# EAGLE design split_node_02 (EAGLE 9.6.2)
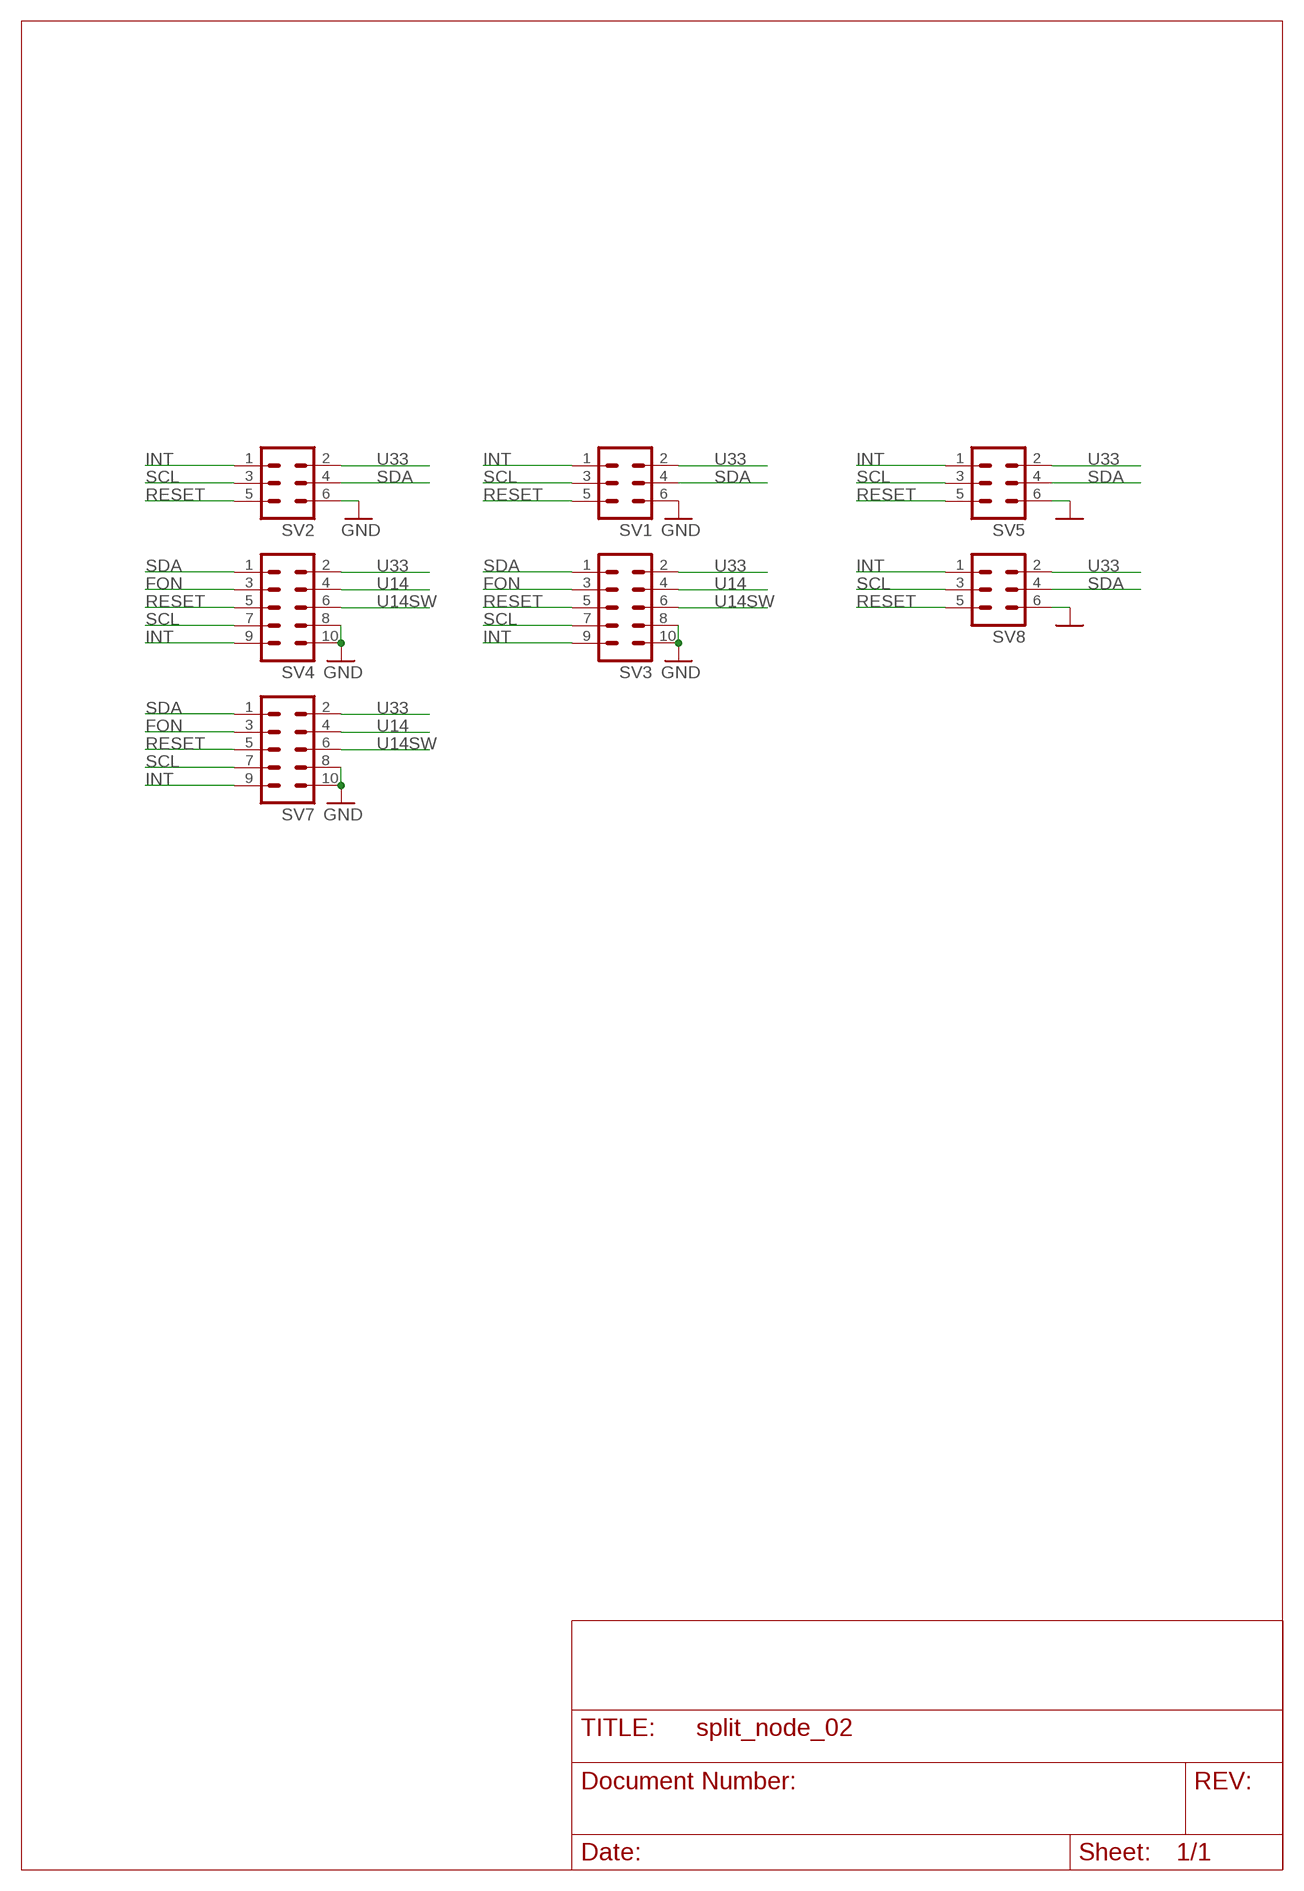
[diagram p0: schematic, sheet 1]

## Parts
SV1  ML6  [ML6]
SV2  ML6  [ML6]
SV3  ML10  [ML10]
SV4  ML10  [ML10]
SV5  ML6  [ML6]
SV7  ML10  [ML10]
SV8  ML6  [ML6]

## Nets
FON: SV3.3 SV4.3 SV7.3
GND: SV1.6 SV2.6 SV3.8 SV3.10 SV4.8 SV4.10 SV5.6 SV7.8 SV7.10 SV8.6
INT: SV1.1 SV2.1 SV3.9 SV4.9 SV5.1 SV7.9 SV8.1
RESET: SV1.5 SV2.5 SV3.5 SV4.5 SV5.5 SV7.5 SV8.5
SCL: SV1.3 SV2.3 SV3.7 SV4.7 SV5.3 SV7.7 SV8.3
SDA: SV1.4 SV2.4 SV3.1 SV4.1 SV5.4 SV7.1 SV8.4
U14: SV3.4 SV4.4 SV7.4
U14SW: SV3.6 SV4.6 SV7.6
U33: SV1.2 SV2.2 SV3.2 SV4.2 SV5.2 SV7.2 SV8.2

## Library data of the parts
SV1 SV2 SV5 SV8 = con-harting-ml:ML6: HARTING; OC_FARNELL: unknown; OC_NEWARK: unknown
SV3 SV4 SV7 = con-harting-ml:ML10: HARTING; OC_FARNELL: unknown; OC_NEWARK: unknown

## Net classes
0 default: width 0.508 mm

## Board
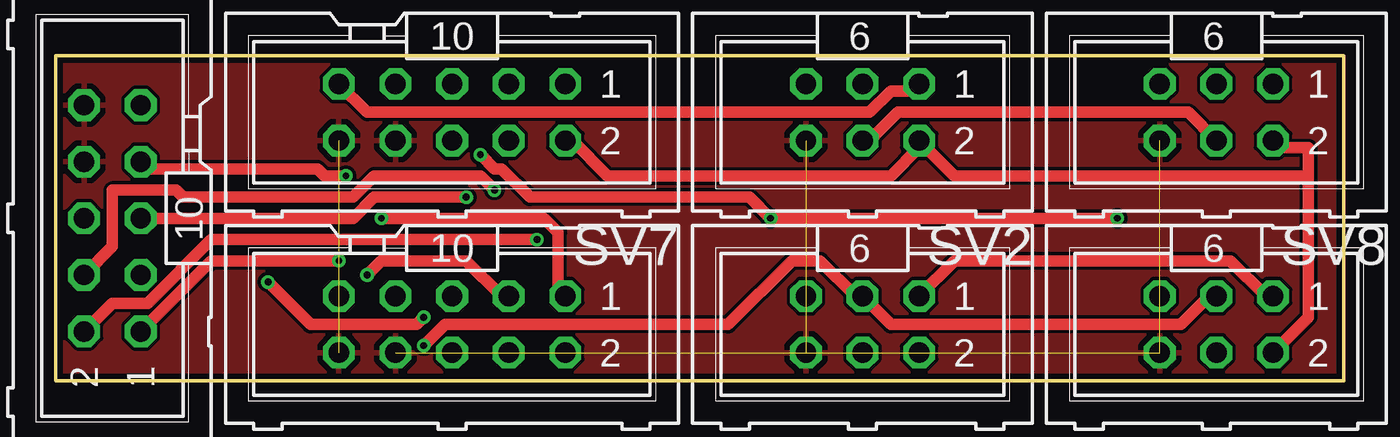
[diagram p1: board, top side]
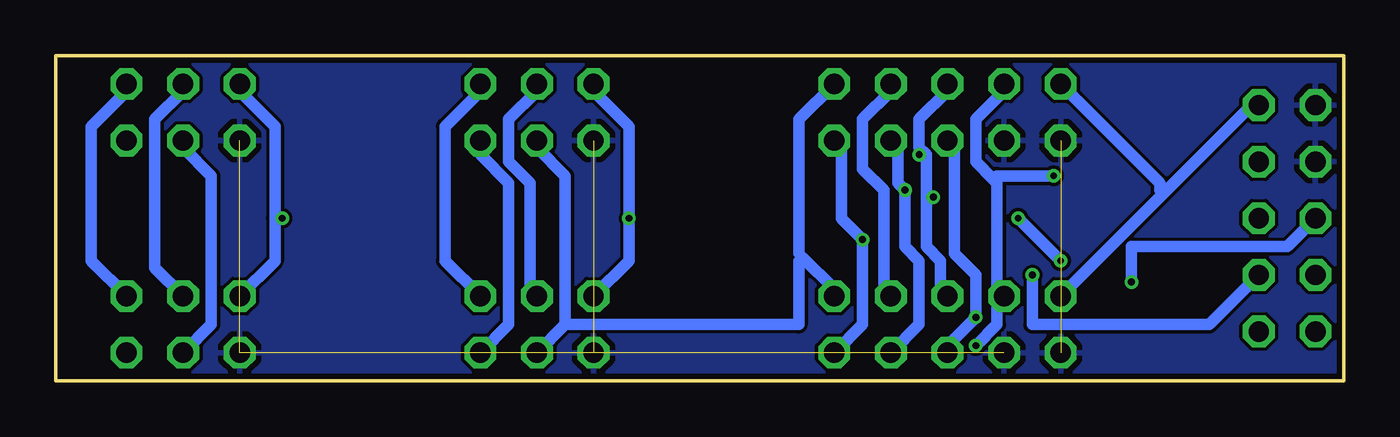
[diagram p2: board, bottom side, seen from below]

Size 57.78 x 14.61 mm. Coordinates in mm from the lower left corner, seen from the top.
Outline: 0,0 57.78,0 57.78,14.61 0,14.61 0,0
Copper layers (1*16): Top 0.035mm / dielectric 1.5mm / Bottom 0.035mm
Design rules "eagle": minimum track width 5mil, minimum drill 12mil, track to track 6mil, track to pad 6mil, pad to pad 6mil, via to via 6mil, smd to smd 0mil, copper to edge 10mil, drill to drill 10mil, minimum pad ring 10mil, minimum via ring 6mil, stop-mask expansion 2mil, vias tented up to drill 25mil, thermal gap 10mil

### Footprints (pad centres in the part's own frame; a part is rotated, then mirrored left to right if it is on the bottom)
ML6 = drill 0.914 octagon: 1 -2.54,-1.27; 2 -2.54,1.27; 3 0,-1.27; 4 0,1.27; 5 2.54,-1.27; 6 2.54,1.27
ML10 = drill 0.914 octagon: 1 -5.08,-1.27; 2 -5.08,1.27; 3 -2.54,-1.27; 4 -2.54,1.27; 5 0,-1.27; 6 0,1.27; 7 2.54,-1.27; 8 2.54,1.27; 9 5.08,-1.27; 10 5.08,1.27

### Placement (x,y rotation side)
SV1  52.07,2.54 180 top
SV2  36.2,12.06 180 top
SV3  2.54,7.3 90 top
SV4  17.78,2.54 180 top
SV5  36.2,2.54 180 top
SV7  17.78,12.06 180 top
SV8  52.07,12.06 180 top

### Tracks (layer width: path | path; a pad name or v marks a point on that pad's centre or on a via)
FON  (via drill 0.3)
  Top 0.508: v13.97,4.76 14.61,5.4 18.41,5.4 20,3.81 SV4.3
  Bottom 0.508: SV4.3 20.64,4.13 20.64,8.57 21.59,9.53 21.59,11.75 20.32,13.02 SV7.3 | SV3.3 6.03,2.54 13.97,2.54 v13.97,4.76
GND  (5 unrouted)
  pour Top: 0,0 57.78,0 57.78,14.61 0,14.61
  pour Bottom: 0,0 57.78,0 57.78,14.61 0,14.61
INT
  Top 0.508: SV5.1 40.32,5.4 52.7,5.4 54.29,3.81 SV1.1 | SV7.9 13.97,12.06 36.51,12.06 37.47,13.02 38.42,13.02 SV2.1
  Bottom 0.508: 8.1,8.41 4.13,12.38 SV3.9 | 8.1,8.41 SV4.9 | SV7.9 8.26,8.89 8.26,8.57 8.1,8.41 | SV5.1 40.32,5.4 40.32,11.43 38.73,13.02 SV2.1 | SV1.1 56.2,5.4 56.2,11.43 54.61,13.02 SV8.1
RESET  (via drill 0.3)
  Top 0.508: SV3.5 13.34,7.3 14.29,8.26 v18.41,8.26 | v47.62,7.3 v32.07,7.3 31.11,8.26 21.27,8.26 20,9.53 19.68,9.53 v19.05,10.16
  Bottom 0.508: SV4.5 18.1,4.13 18.1,5.4 18.73,6.03 18.73,8.26 | 18.73,8.26 18.73,10.16 18.89,10.32 | 18.89,10.32 19.05,10.48 19.05,11.75 17.78,13.02 SV7.5 | 18.73,8.26 v18.41,8.26 | SV5.5 32.07,5.4 v32.07,7.3 32.07,11.43 33.66,13.02 SV2.5 | SV1.5 47.94,5.4 47.94,7.3 | 47.94,7.3 47.94,11.43 49.53,13.02 SV8.5 | 47.94,7.3 v47.62,7.3 | v19.05,10.16 18.89,10.32
SCL  (via drill 0.3)
  Top 0.508: SV3.7 4.13,9.53 11.75,9.53 12.06,9.21 v13.02,9.21 | SV1.3 51.75,3.81 50.48,2.54 37.47,2.54 SV5.3 35.88,3.81 34.29,5.4 33.02,5.4 30.16,2.54 17.46,2.54 v16.51,1.59
  Bottom 0.508: 15.72,9.05 16.51,9.84 16.51,11.75 15.24,13.02 SV7.7 | 15.72,9.05 15.56,8.89 15.56,4.13 SV4.7 15.56,3.81 15.56,2.54 v16.51,1.59 | v13.02,9.21 15.56,9.21 15.72,9.05 | SV5.3 36.51,4.13 36.51,8.89 37.47,9.84 37.47,11.75 36.2,13.02 SV2.3 | SV1.3 53.34,5.08 53.34,11.75 52.07,13.02 SV8.3
SDA  (via drill 0.3)
  Top 0.508: SV3.1 6.99,5.4 v12.7,5.4 | v14.61,7.3 21.91,7.3 22.54,6.67 22.54,3.81 SV4.1 | SV8.4 50.8,12.06 37.78,12.06 36.51,10.79 SV2.4
  Bottom 0.508: SV1.4 50.8,2.54 50.8,9.21 52.07,10.48 SV8.4 | 34.92,2.54 SV5.4 | 34.92,2.54 34.92,9.21 36.2,10.48 SV2.4 | v14.61,7.3 v12.7,5.4 | SV7.1 24.45,11.75 24.45,5.71 24.29,5.56 | 24.29,5.56 22.86,4.13 SV4.1 | 34.92,2.54 24.45,2.54 24.45,5.4 24.29,5.56
U14  (via drill 0.3)
  Top 0.508: SV3.4 2.54,6.03 2.54,8.57 5.4,8.57 5.71,8.26 13.34,8.26 14.29,9.21 19.05,9.21 v19.68,8.57
  Bottom 0.508: SV7.4 20,10.48 20,8.89 v19.68,8.57 19.68,6.03 19.05,5.4 19.05,2.54 SV4.4
U14SW  (via drill 0.3)
  Top 0.508: v9.53,4.45 11.43,2.54 16.19,2.54 v16.51,2.86
  Bottom 0.508: SV3.6 2.54,6.03 9.53,6.03 v9.53,4.45 | SV4.6 17.78,1.59 v16.51,2.86 16.51,4.76 17.46,5.71 17.46,10.48 SV7.6
U33  (via drill 0.3)
  Top 0.508: SV1.2 56.2,2.86 56.2,9.21 | 56.2,9.21 56.2,10.48 54.93,10.48 SV8.2 | 56.2,9.21 40.32,9.21 SV2.2 38.73,10.48 37.47,9.21 24.77,9.21 23.18,10.79 SV7.2 | SV3.2 2.54,3.49 4.13,3.49 6.99,6.35 v21.59,6.35
  Bottom 0.508: SV5.2 37.47,2.54 37.47,8.89 38.73,10.16 SV2.2 | SV7.2 22.54,10.48 22.54,7.3 v21.59,6.35 21.59,2.54 SV4.2